# Altium schematic sheet Detector.SchDoc
size A4
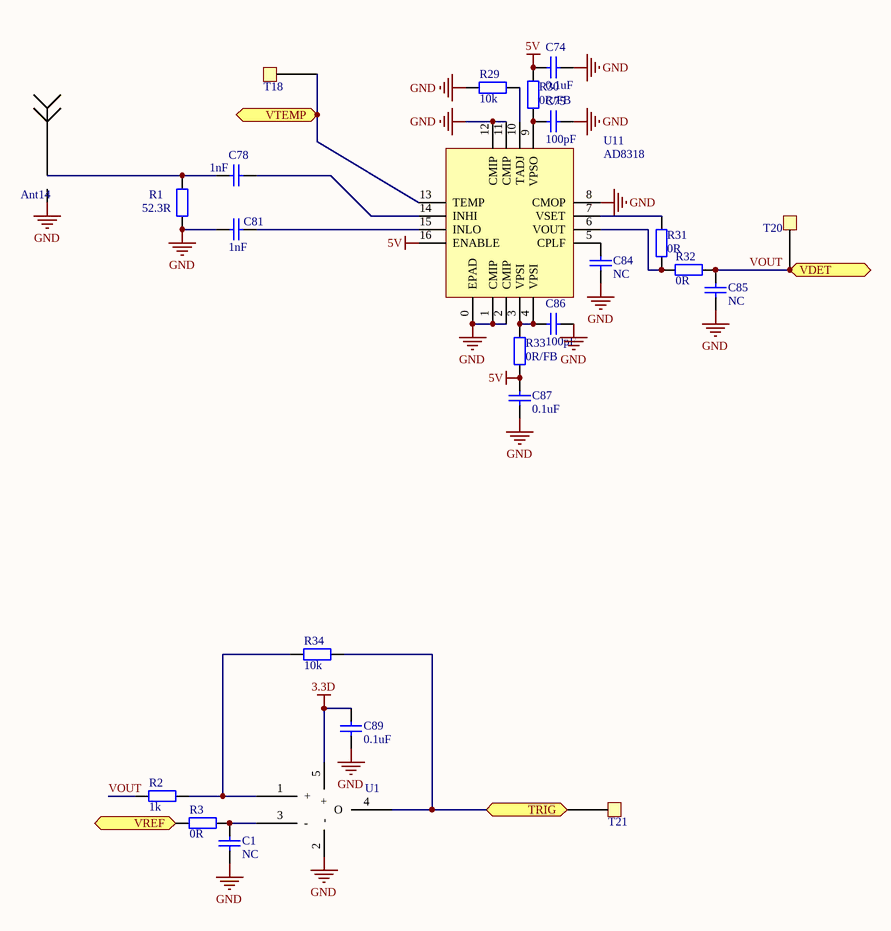
[diagram p0: Detector.SchDoc]

## Parts
Ant14  Antenna  [SMA-2]  (value not drawn)
C1  value NC  [0402]  (hidden comment: Cap)
C74  value 0.1uF  [0402]  (hidden comment: Cap)
C75  value 100pF  [0402]  (hidden comment: Cap)
C78  value 1nF  [0402]  (hidden comment: Cap)
C81  value 1nF  [0402]  (hidden comment: Cap)
C84  value NC  [0402]  (hidden comment: Cap)
C85  value NC  [0402]  (hidden comment: Cap)
C86  value 100pF  [0402]  (hidden comment: Cap)
C87  value 0.1uF  [0402]  (hidden comment: Cap)
C89  value 0.1uF  [0402]  (hidden comment: Cap)
R1  value 52.3R  [0402]  (hidden comment: Res2)
R2  value 1k  [0402]  (hidden comment: Res2)
R3  value 0R  [0402]  (hidden comment: Res2)
R29  value 10k  [0402]  (hidden comment: Res2)
R30  value 0R/FB  [0402]  (hidden comment: Res2)
R31  value 0R  [0402]  (hidden comment: Res2)
R32  value 0R  [0402]  (hidden comment: Res2)
R33  value 0R/FB  [0402]  (hidden comment: Res2)
R34  value 10k  [0402]  (hidden comment: Res2)
T18  TestPad  [TestPad - 1mm]  (value not drawn)
T20  TestPad  [TestPad - 1mm]  (value not drawn)
T21  TestPad  [TestPad - 1mm]  (value not drawn)
U1  OP-SOT23  [SOT23-5]  (value not drawn)
U11  AD8318  [AD8318]

## Ports
TRIG, VDET, VREF, VTEMP

## Nets
3.3D: C89.2 U1.5(+)
5V: C74.2 C87.2 R30.1 R33.2 U11.16(ENABLE)
GND: Ant14.GND(G) C1.2 C74.1 C75.1 C81.2 C84.2 C85.2 C86.1 C87.1 C89.1 R1.2 R29.1 U1.2(-) U11.0(EPAD) U11.1(CMIP) U11.2(CMIP) U11.8(CMOP) U11.11(CMIP) U11.12(CMIP)
TRIG: R34.1 T21.1 U1.4(O) ; port TRIG
VOUT: C85.1 R2.2 R32.2 T20.1 ; port VDET
VREF: R3.1 ; port VREF
VTEMP: T18.1 U11.13(TEMP) ; port VTEMP
NetAnt14_1: Ant14.1 C78.2 R1.1
NetC1_1: C1.1 R3.2 U1.3(-)
NetC75_2: C75.2 R30.2 U11.9(VPSO)
NetC78_1: C78.1 U11.14(INHI)
NetC81_1: C81.1 U11.15(INLO)
NetC84_1: C84.1 U11.5(CPLF)
NetC86_2: C86.2 R33.1 U11.3(VPSI) U11.4(VPSI)
NetR2_1: R2.1 R34.2 U1.1(+)
NetR29_2: R29.2 U11.10(TADJ)
NetR31_1: R31.1 U11.7(VSET)
NetR31_2: R31.2 R32.1 U11.6(VOUT)

## Library data of the parts
C1 C74 C75 C78 C81 C84-C87 C89 = Cap: Capacitor; Published: 8-Jun-2000; LatestRevisionDate: 17-Jul-2002; LatestRevisionNote: Re-released for DXP Platform.; PackageReference: RAD-0.3; Publisher: Altium Limited; PackageDescription: Radial Cap, Thru-Hole; 2 Leads; 0.3 in Pin Spacing
R1-R3 R29-R34 = Res2: Resistor; Published: 8-Jun-2000; LatestRevisionDate: 17-Jul-2002; LatestRevisionNote: Re-released for DXP Platform.; PackageReference: AXIAL-0.4; Publisher: Altium Limited; PackageDescription: Axial Device, Thru-Hole; 2 Leads; 0.4 in Pin Spacing